# EAGLE design ai_breakout_rpibplus (EAGLE 7.1.0)
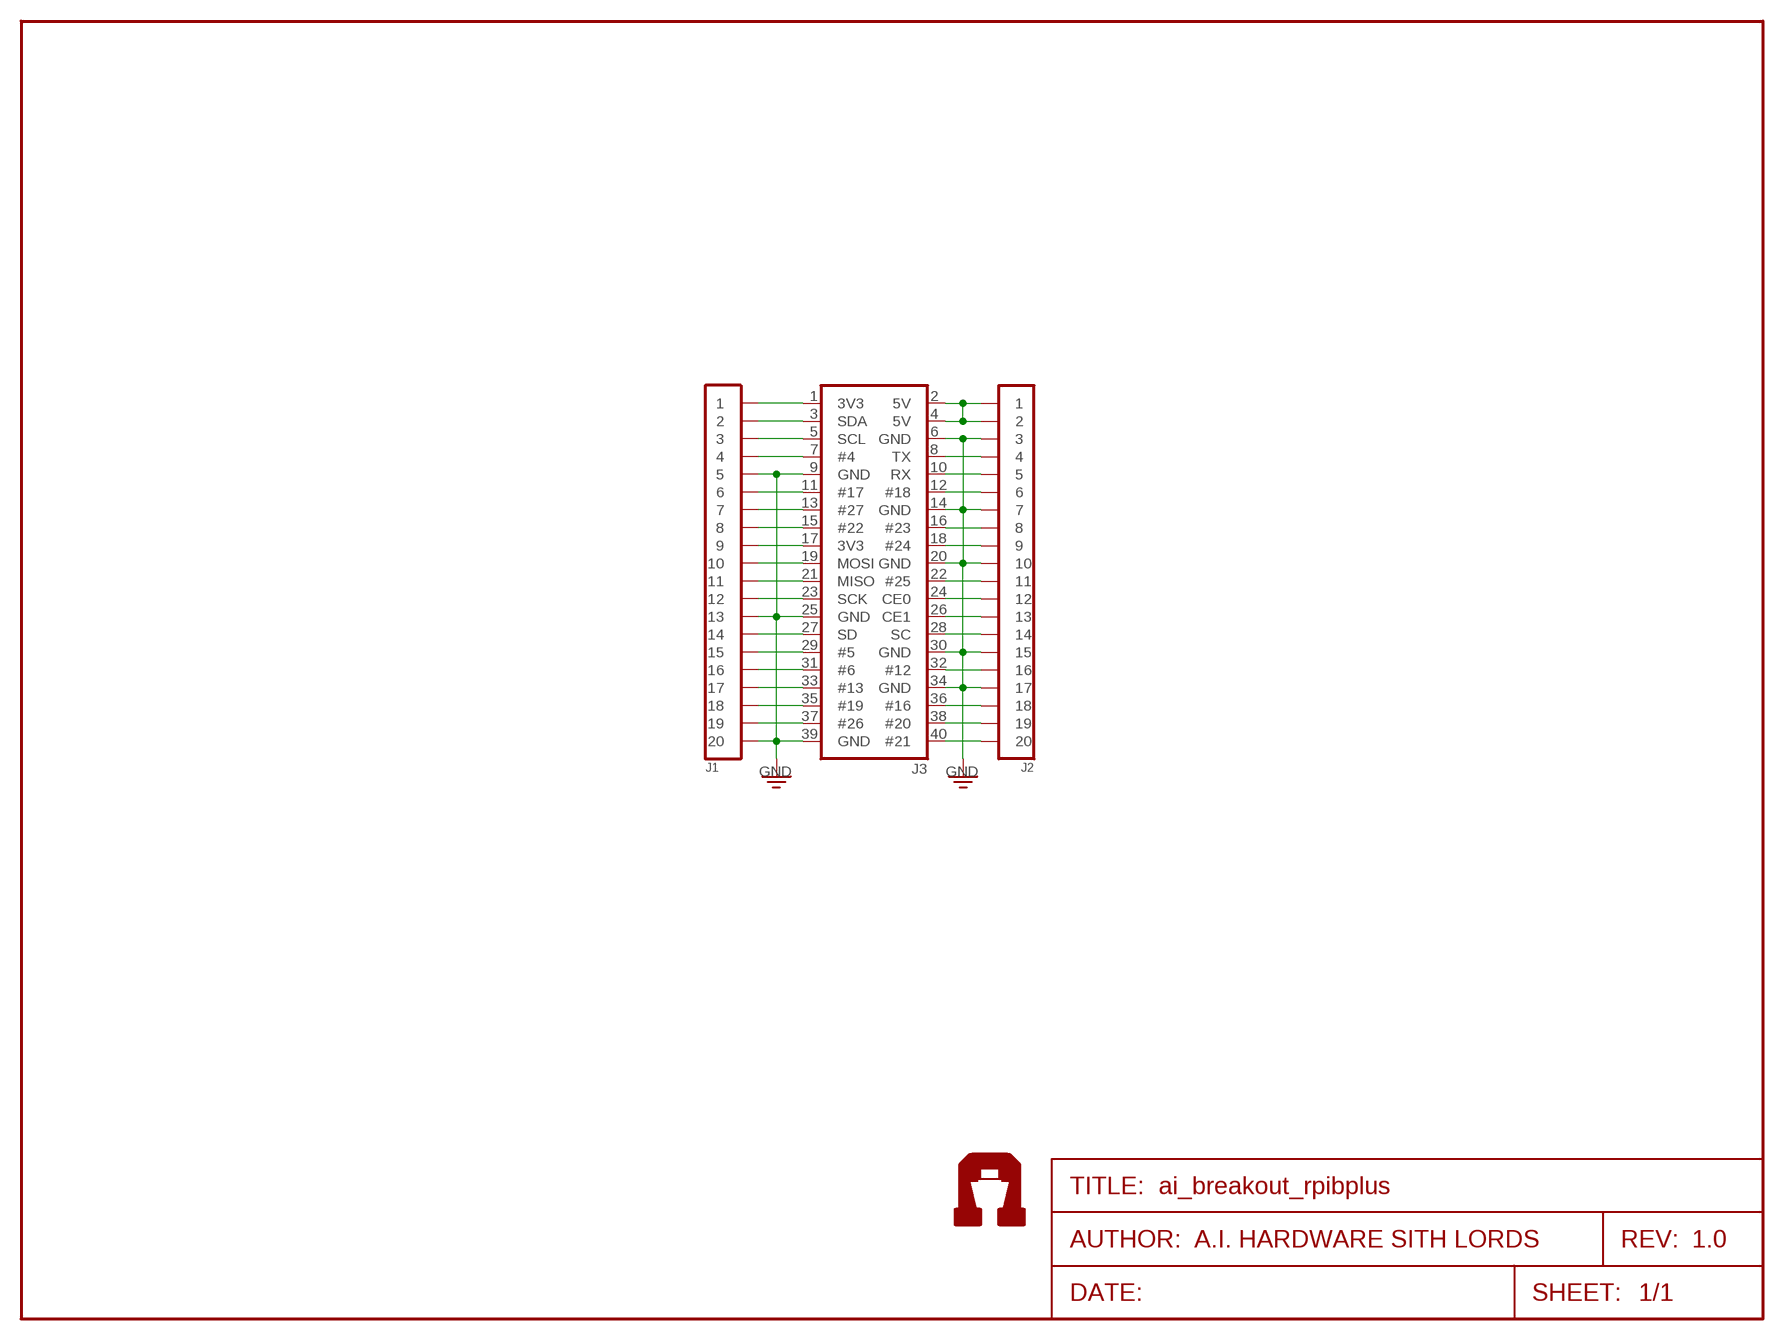
[diagram p0: schematic, sheet 1]
FRAME1 (FRAME-LETTER): AUTHOR: A.I. HARDWARE SITH LORDS; REV: 1.0

## Parts
J1  1X20  [1X20]
J2  1X20NOFIRST  [1X20-NOFIRST]
J3  2X20-RPI-BRK  [2X20-RPI-BRK]
U$1  AI-LOGOXS  [AI-LOGO-XS]
U$2  AI-LOGOXS  [AI-LOGO-XS]

## Nets
GND: J1.5 J1.13 J1.20 J2.3 J2.7 J2.10 J2.15 J2.17 J3.6(GND) J3.9(GND) J3.14(GND) J3.20(GND) J3.25(GND) J3.30(GND) J3.34(GND) J3.39(GND)
N$1: J2.1 J2.2 J3.2(5V) J3.4(5V)
N$2: J1.19 J3.37(#26)
N$4: J1.18 J3.35(#19)
N$6: J1.17 J3.33(#13)
N$9: J1.16 J3.31(#6)
N$12: J1.15 J3.29(#5)
N$13: J1.14 J3.27(SD)
N$15: J1.12 J3.23(SCK)
N$16: J1.11 J3.21(MISO)
N$17: J1.10 J3.19(MOSI)
N$18: J1.9 J3.17(3V3)
N$19: J1.8 J3.15(#22)
N$20: J1.7 J3.13(#27)
N$21: J1.1 J3.1(3V3)
N$22: J1.2 J3.3(SDA)
N$23: J1.3 J3.5(SCL)
N$24: J1.4 J3.7(#4)
N$26: J1.6 J3.11(#17)
N$28: J2.8 J3.16(#23)
N$29: J2.16 J3.32(#12)
N$30: J2.4 J3.8(TX)
N$31: J2.5 J3.10(RX)
N$32: J2.6 J3.12(#18)
N$35: J2.9 J3.18(#24)
N$37: J2.11 J3.22(#25)
N$38: J2.12 J3.24(CE0)
N$39: J2.13 J3.26(CE1)
N$40: J2.14 J3.28(SC)
N$44: J2.18 J3.36(#16)
N$45: J2.19 J3.38(#20)
N$46: J2.20 J3.40(#21)

## Library data of the parts
J1 J2 = Ai_Connectors:1X20
J3 = Ai_Connectors:2X20-RPI
U$1 U$2 = Ai_Miscellany:AI-LOGO

## Board
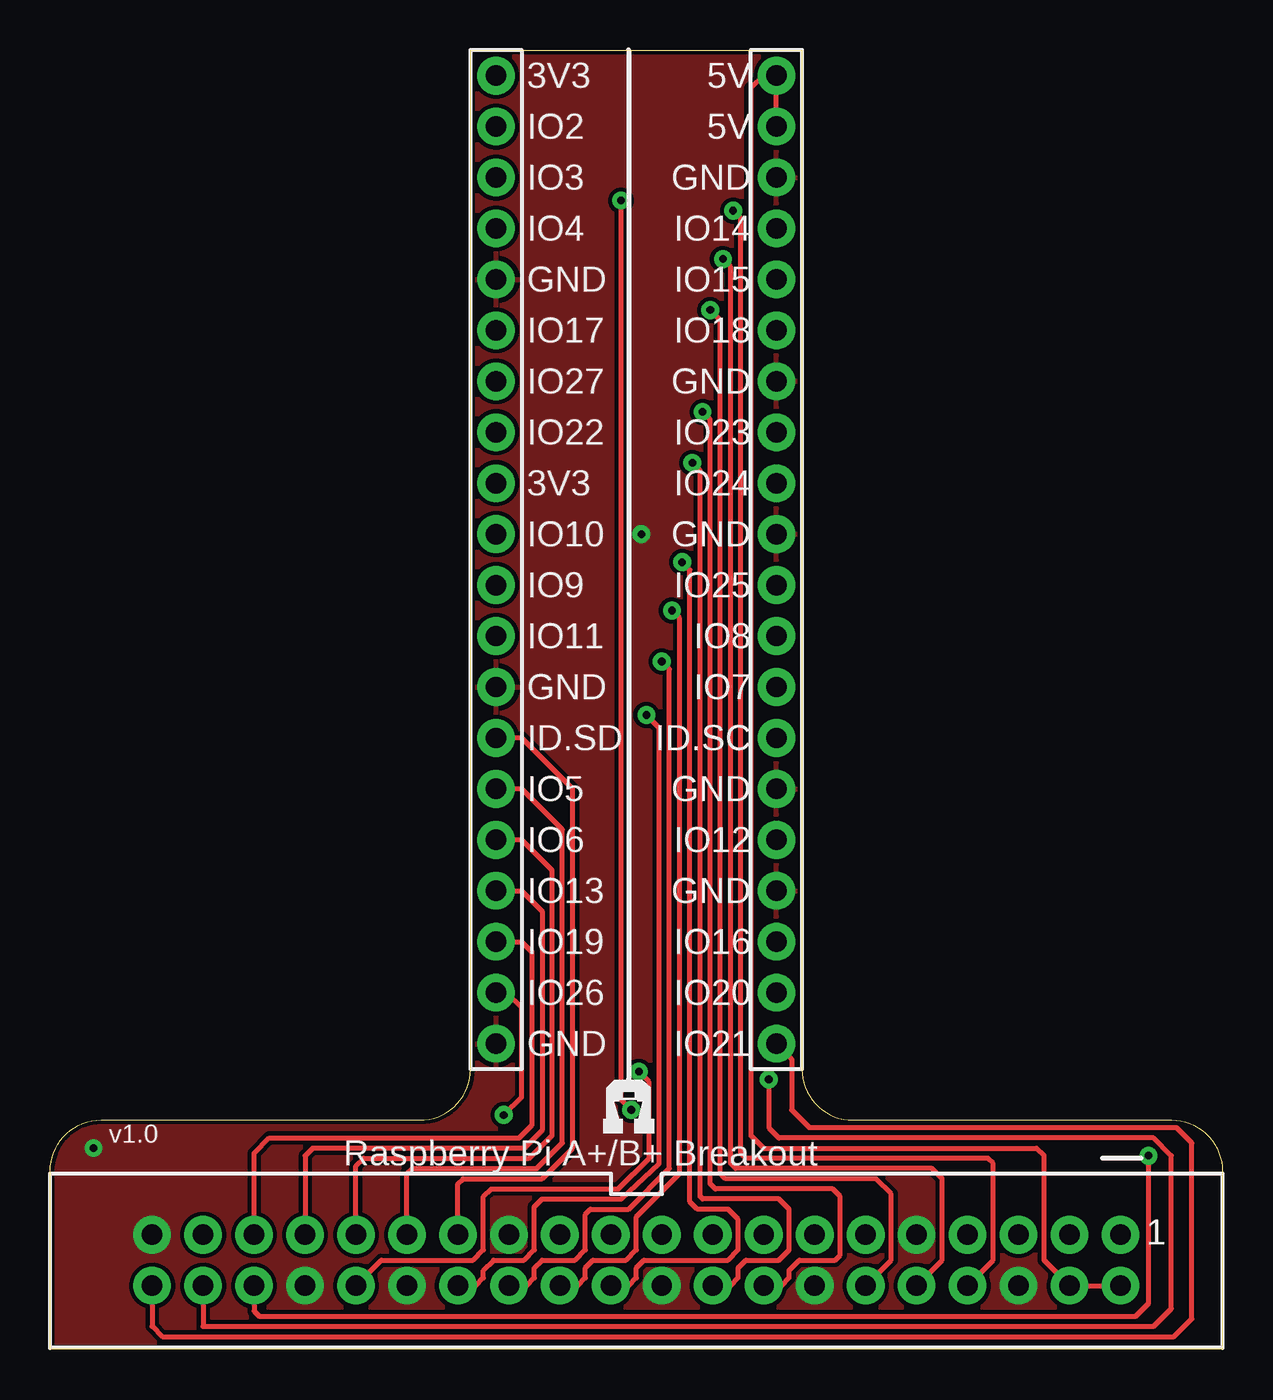
[diagram p1: board, top side]
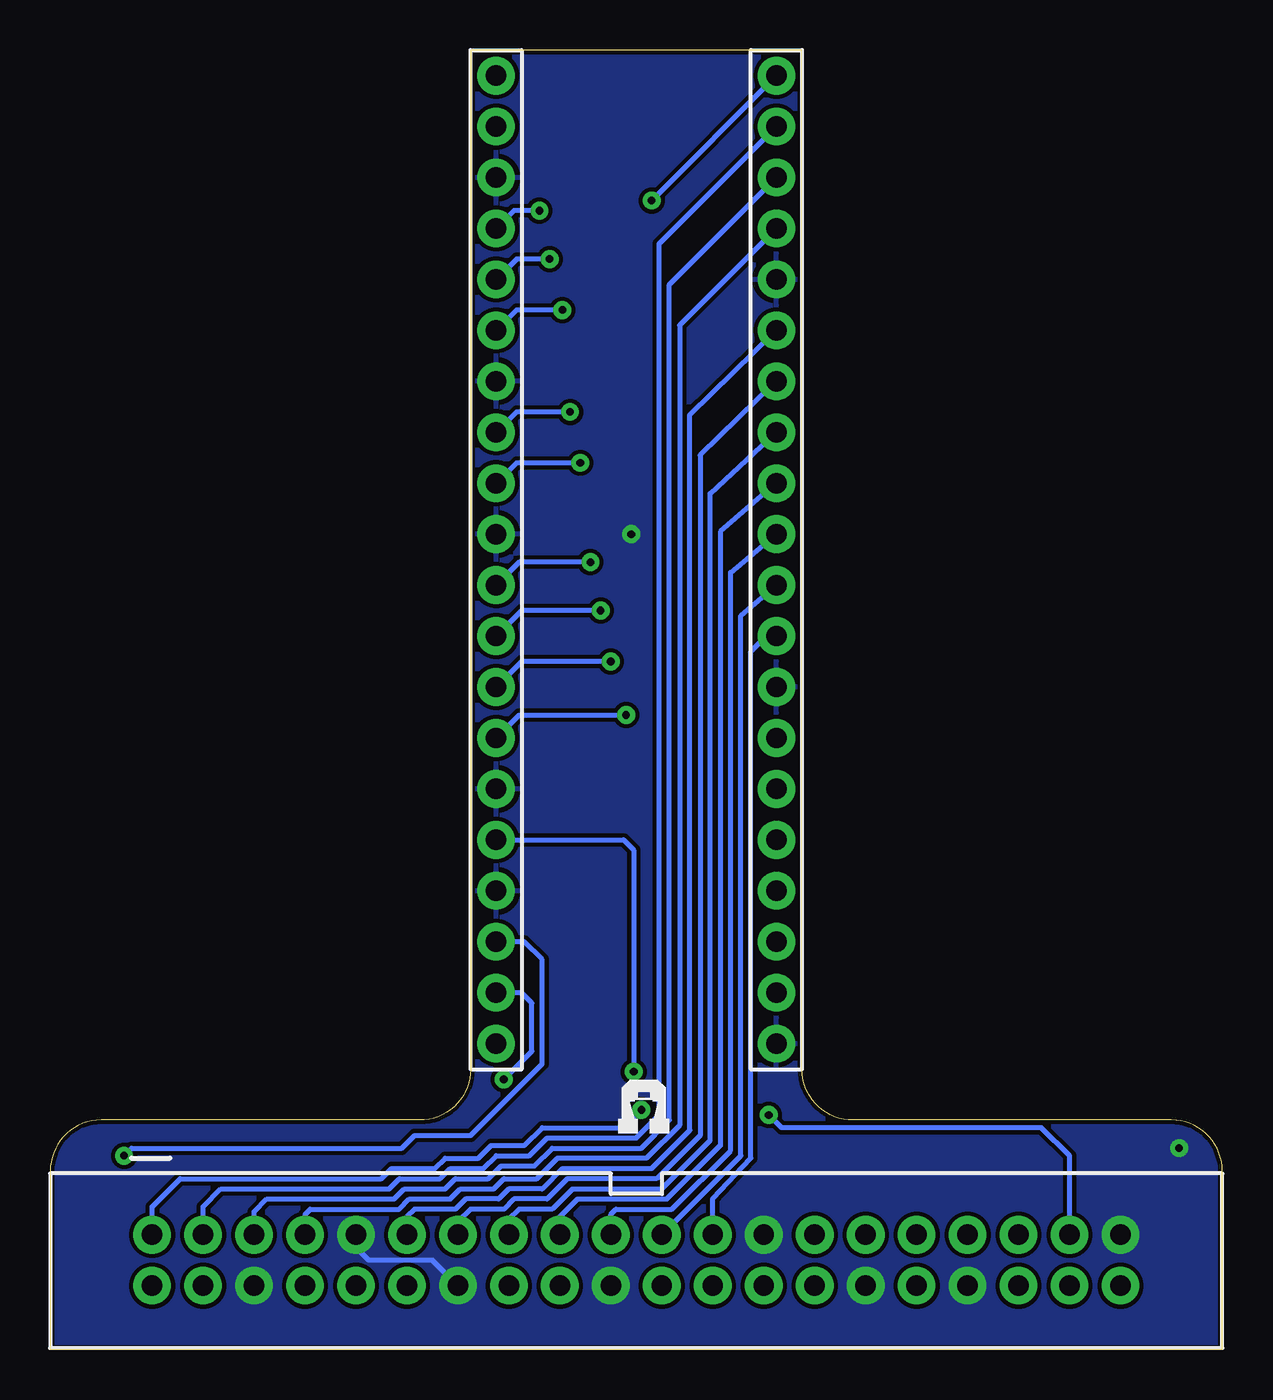
[diagram p2: board, bottom side, seen from below]

Size 58.42 x 64.77 mm. Coordinates in mm from the lower left corner, seen from the top.
Outline: 0,0 0,8.89 arc-90 2.54,11.43 18.41,11.43 arc90 20.95,13.97 20.95,64.77 37.47,64.77 37.47,13.97 arc90 40.01,11.43 55.88,11.43 arc-90 58.42,8.89 58.42,0 0,0
Copper layers (1*16): Top 0.035mm / dielectric 1.5mm / Bottom 0.035mm
Design rules "ai_2layer": minimum track width 7mil, minimum drill 15mil, track to track 8mil, track to pad 8mil, pad to pad 8mil, via to via 8mil, smd to smd 8mil, copper to edge 8mil, drill to drill 8mil, minimum pad ring 12mil, minimum via ring 10mil, stop-mask expansion 4mil, vias tented up to drill 20mil, thermal gap 10mil

### Footprints (pad centres in the part's own frame; a part is rotated, then mirrored left to right if it is on the bottom)
1X20 = drill 1.016 pad 1.88: 1 -24.13,0; 2 -21.59,0; 3 -19.05,0; 4 -16.51,0; 5 -13.97,0; 6 -11.43,0; 7 -8.89,0; 8 -6.35,0; 9 -3.81,0; 10 -1.27,0; 11 1.27,0; 12 3.81,0; 13 6.35,0; 14 8.89,0; 15 11.43,0; 16 13.97,0; 17 16.51,0; 18 19.05,0; 19 21.59,0; 20 24.13,0
1X20-NOFIRST = drill 1.016 pad 1.88: 1 -24.13,0; 2 -21.59,0; 3 -19.05,0; 4 -16.51,0; 5 -13.97,0; 6 -11.43,0; 7 -8.89,0; 8 -6.35,0; 9 -3.81,0; 10 -1.27,0; 11 1.27,0; 12 3.81,0; 13 6.35,0; 14 8.89,0; 15 11.43,0; 16 13.97,0; 17 16.51,0; 18 19.05,0; 19 21.59,0; 20 24.13,0
2X20-RPI-BRK = drill 1.016 pad 1.88: 1 -24.13,-1.27; 2 -24.13,1.27; 3 -21.59,-1.27; 4 -21.59,1.27; 5 -19.05,-1.27; 6 -19.05,1.27; 7 -16.51,-1.27; 8 -16.51,1.27; 9 -13.97,-1.27; 10 -13.97,1.27; 11 -11.43,-1.27; 12 -11.43,1.27; 13 -8.89,-1.27; 14 -8.89,1.27; 15 -6.35,-1.27; 16 -6.35,1.27; 17 -3.81,-1.27; 18 -3.81,1.27; 19 -1.27,-1.27; 20 -1.27,1.27; 21 1.27,-1.27; 22 1.27,1.27; 23 3.81,-1.27; 24 3.81,1.27; 25 6.35,-1.27; 26 6.35,1.27; 27 8.89,-1.27; 28 8.89,1.27; 29 11.43,-1.27; 30 11.43,1.27; 31 13.97,-1.27; 32 13.97,1.27; 33 16.51,-1.27; 34 16.51,1.27; 35 19.05,-1.27; 36 19.05,1.27; 37 21.59,-1.27; 38 21.59,1.27; 39 24.13,-1.27; 40 24.13,1.27

### Placement (x,y rotation side)
J1  22.23,39.37 270 top
J2  36.2,39.37 270 top
J3  29.21,4.45 180 top
U$1  27.56,10.79 0 top
U$2  30.1,10.79 0 bottom

### Tracks (layer width: path | path; a pad name or v marks a point on that pad's centre or on a via)
GND  (via drill 0.38)
  Bottom 0.254: J3.14 39.37,4.45 42.55,4.45 43.18,5.08 J3.9
  other vias: 2.16,10.03 29.46,40.64
  pour Top: 0,0 0,8.89 arc-90 2.54,11.43 18.41,11.43 arc90 20.95,13.97 20.95,64.77 37.47,64.77 37.47,13.97 arc90 40.01,11.43 55.88,11.43 arc-90 58.42,8.89 58.42,0
  pour Bottom: 0,0 0,8.89 arc-90 2.54,11.43 18.41,11.43 arc90 20.95,13.97 20.95,64.77 37.47,64.77 37.47,13.97 arc90 40.01,11.43 55.88,11.43 arc-90 58.42,8.89 58.42,0
N$1
  Top 0.254: J2.2 J2.1 35.56,63.5 34.92,62.87 34.92,10.67 35.56,10.03 49.15,10.03 49.53,9.65 49.53,4.45 J3.4 J3.2
N$2  (via drill 0.38)
  Top 0.254: J1.19 22.73,17.78 23.5,17.02 23.5,12.57 v22.61,11.68
  Bottom 0.254: J3.37 7.62,9.65 9.02,11.05 21.97,11.05 v22.61,11.68
N$4
  Top 0.254: J3.35 10.16,9.78 10.92,10.54 23.37,10.54 24,11.18 24,19.81 23.5,20.32 J1.18
N$6
  Top 0.254: J1.17 23.5,22.86 24.51,21.84 24.51,10.92 23.62,10.03 13.08,10.03 12.7,9.65 J3.33
N$9
  Top 0.254: J3.31 15.24,9.14 15.62,9.53 23.88,9.53 25.02,10.67 25.02,23.88 23.5,25.4 J1.16
N$12
  Top 0.254: J3.29 17.78,8.76 18.03,9.02 24.26,9.02 25.53,10.29 25.53,25.91 23.5,27.94 J1.15
N$13
  Top 0.254: J3.27 20.32,8.26 20.57,8.51 24.51,8.51 26.04,10.03 26.04,27.94 23.5,30.48 J1.14
N$15
  Bottom 0.254: J3.23 25.4,7.49 23.5,9.53 23.5,34.8 22.73,35.56 J1.12
N$16
  Bottom 0.254: J3.21 24,9.65 24,36.58 J1.11
N$17
  Bottom 0.254: J3.19 30.48,6.73 30.23,6.99 27.43,6.99 24.51,9.91 24.51,38.73 J1.10
N$18
  Bottom 0.254: J1.9 25.02,40.77 25.02,10.16 27.69,7.49 32.13,7.49 33.02,6.6 J3.17
N$19
  Bottom 0.254: J1.8 25.53,42.67 25.53,10.41 27.94,8 32.38,8 33.4,6.99 35.05,6.99 35.56,6.48 J3.15
N$20
  Bottom 0.254: J1.7 26.04,44.58 26.04,10.67 28.19,8.51 32.64,8.51 33.66,7.49 35.31,7.49 35.81,6.99 37.47,6.99 38.1,6.35 J3.13
N$21  (via drill 0.38)
  Top 0.254: v28.96,11.94 28.45,12.45 v28.45,57.28
  Bottom 0.254: v28.96,11.94 29.84,11.05 33.91,11.05 34.8,10.16 36.45,10.16 37.08,9.53 38.73,9.53 39.24,9.02 41.4,9.02 41.91,8.51 51.94,8.51 53.34,7.11 J3.1 | v28.45,57.28 J1.1
N$22
  Bottom 0.254: J1.2 28.07,55.12 28.07,11.68 29.21,10.54 33.66,10.54 34.54,9.65 36.2,9.65 36.83,9.02 38.48,9.02 38.99,8.51 41.02,8.51 41.53,8 49.91,8 50.8,7.11 J3.3
N$23
  Bottom 0.254: J1.3 27.56,53.09 27.56,11.43 28.96,10.03 33.4,10.03 34.29,9.14 35.94,9.14 36.58,8.51 38.23,8.51 38.73,8 40.77,8 41.27,7.49 47.62,7.49 48.26,6.86 J3.5
N$24
  Bottom 0.254: J1.4 27.05,51.05 27.05,11.18 28.7,9.53 33.15,9.53 34.16,8.51 35.81,8.51 36.32,8 37.97,8 38.48,7.49 40.51,7.49 41.02,6.99 45.47,6.99 45.72,6.73 J3.7
N$26
  Bottom 0.254: J1.6 26.54,46.61 26.54,10.92 28.45,9.02 32.89,9.02 33.91,8 35.56,8 36.07,7.49 37.72,7.49 38.23,6.99 40.26,6.99 40.64,6.6 J3.11
N$28  (via drill 0.38)
  Top 0.254: v32.51,46.74 32.89,46.35 32.89,8.26 33.15,8 38.99,8 39.37,7.62 39.37,4.7 39.12,4.45 37.34,4.45 36.83,3.94 36.83,3.56 36.45,3.17 J3.16
  Bottom 0.254: v32.51,46.74 35.18,46.74 J2.8
N$29  (via drill 0.38)
  Top 0.254: J3.32 16.51,4.45 21.08,4.45 21.59,4.95 21.59,7.62 21.97,8 28.32,8 29.84,9.53 29.84,13.34 v29.34,13.84
  Bottom 0.254: J2.16 29.84,25.4 29.34,24.89 v29.34,13.84
N$30  (via drill 0.38)
  Top 0.254: J3.8 46.99,4.45 46.99,9.27 46.74,9.53 34.67,9.53 34.42,9.78 34.42,56.39 v34.04,56.77
  Bottom 0.254: v34.04,56.77 35.31,56.77 J2.4
N$31  (via drill 0.38)
  Top 0.254: J3.10 44.45,4.45 44.45,8.51 43.94,9.02 34.16,9.02 33.91,9.27 33.91,53.98 v33.53,54.36
  Bottom 0.254: v33.53,54.36 35.18,54.36 J2.5
N$32  (via drill 0.38)
  Top 0.254: J3.12 41.91,4.45 41.91,7.75 41.15,8.51 33.66,8.51 33.4,8.76 33.4,51.31 v32.89,51.82
  Bottom 0.254: v32.89,51.82 35.18,51.82 J2.6
N$35  (via drill 0.38)
  Top 0.254: v32,44.2 32.38,43.81 32.38,7.62 32.51,7.49 36.32,7.49 36.83,6.99 36.83,4.95 36.32,4.45 34.67,4.45 34.29,4.06 34.29,3.56 33.91,3.17 J3.18
  Bottom 0.254: v32,44.2 35.18,44.2 J2.9
N$37  (via drill 0.38)
  Top 0.254: v31.5,39.24 31.88,38.86 31.88,7.37 32.26,6.99 33.78,6.99 34.29,6.48 34.29,4.95 33.78,4.45 29.59,4.45 29.21,4.06 29.21,3.56 28.83,3.17 J3.22
  Bottom 0.254: v31.5,39.24 35.05,39.24 J2.11
N$38  (via drill 0.38)
  Top 0.254: v30.99,36.83 31.37,36.45 31.37,8.76 29.21,6.6 29.21,4.95 28.7,4.45 27.05,4.45 26.67,4.06 26.67,3.56 26.29,3.17 J3.24
  Bottom 0.254: v30.99,36.83 34.92,36.83 J2.12
N$39  (via drill 0.38)
  Top 0.254: v30.48,34.29 30.86,33.91 30.86,9.02 28.83,6.99 26.92,6.99 26.67,6.73 26.67,4.95 26.16,4.45 24.51,4.45 24.13,4.06 24.13,3.56 23.75,3.17 J3.26
  Bottom 0.254: v30.48,34.29 34.92,34.29 J2.13
N$40  (via drill 0.38)
  Top 0.254: J3.28 21.21,3.17 21.59,3.56 21.59,3.94 22.1,4.45 23.62,4.45 24.13,4.95 24.13,7.11 24.51,7.49 28.45,7.49 30.35,9.27 30.35,30.99 v29.72,31.62
  Bottom 0.254: J2.14 35.05,31.62 v29.72,31.62
N$44  (via drill 0.38)
  Top 0.254: J3.36 10.16,1.91 10.41,1.65 54.1,1.65 54.74,2.29 v54.74,9.65
  Bottom 0.254: v54.74,9.65 54.36,10.03 40.89,10.03 40.26,10.67 37.47,10.67 33.91,14.22 33.91,19.43 34.8,20.32 J2.18
N$45  (via drill 0.38)
  Top 0.254: J3.38 7.62,1.14 54.99,1.14 55.88,2.03 55.88,9.65 54.99,10.54 36.32,10.54 35.81,11.05 v35.81,13.46
  Bottom 0.254: v35.81,13.46 34.42,14.86 34.42,17.27 34.92,17.78 J2.19
N$46
  Top 0.254: J3.40 5.08,1.14 5.59,0.64 56.01,0.64 56.9,1.52 56.9,10.29 56.13,11.05 37.85,11.05 36.96,11.94 36.96,14.48 J2.20

### Text on the board
tPlace: 5V | 3V3 | 5V | IO2 | GND | IO3 | IO14 | IO4 | IO15 | GND | IO18 | IO17 | GND | IO27 | IO23 | IO22 | IO24 | 3V3 | GND | IO10 | IO25 | IO9 | IO8 | IO11 | IO7 | GND | ID.SC | ID.SD | GND | IO5 | IO12 | IO6 | GND | IO13 | IO16 | IO19 | IO20 | IO26 | IO21 | GND | v1.0 | Raspberry Pi A+/B+ Breakout